# EAGLE design midi (EAGLE 6.5.0)
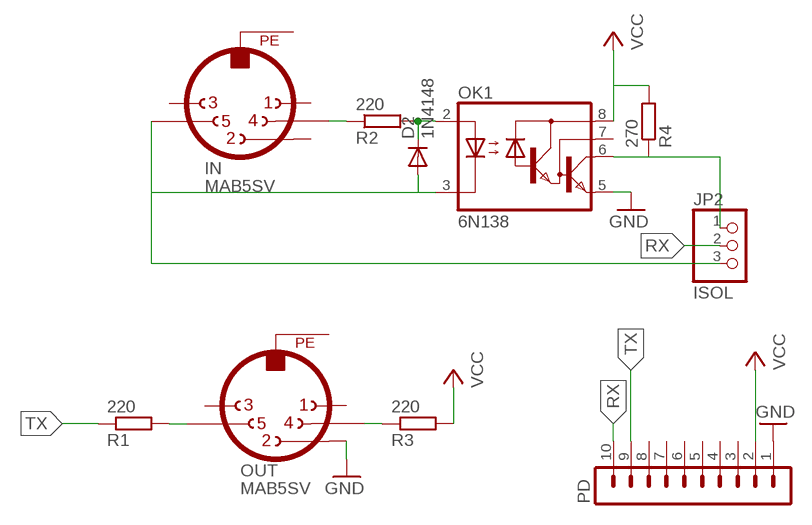
[diagram p0: schematic, sheet 1]

## Parts
D2  1N4148  DIODE-D-2.5  [D-2.5]
IN  MAB5SV  [MAB5SV]
JP2  ISOL  PINHD-1X3/90  [1X03/90]
OK1  6N138  [DIL08]
OUT  MAB5SV  [MAB5SV]
PD  MA10-1W  [MA10-1W]
R1  220  R-EU_0204/7  [0204/7]
R2  220  R-EU_0204/7  [0204/7]
R3  220  R-EU_0207/12  [0207/12]
R4  270  R-EU_0204/5  [0204/5]

## Nets
GND: OK1.5(GND) OUT.2 PD.1
N$1: OUT.4 R3.1
N$2: OUT.5 R1.2
N$3: D2.A IN.5 JP2.3 OK1.3(C)
N$4: D2.C OK1.2(A) R2.2
N$5: IN.4 R2.1
N$6: JP2.1 OK1.6(VO) R4.1
RX: JP2.2 PD.10
TX: PD.9 R1.1
VCC: OK1.8(VCC) PD.2 R3.2 R4.2
Unconnected: IN.1 IN.2 IN.3 OK1.7(VB) OUT.1 OUT.3 PD.3 PD.4 PD.5 PD.6 PD.7 PD.8

## Power pins joined to a net without a drawn wire
PE: IN.PE OUT.PE

## Library data of the parts
D2 = diode:DIODE-: DIODE
IN OUT = con-hirschmann:MAB5SV: Female CONNECTOR 5 pins 90 deg. with shield, vertical (DIN41524); OC_FARNELL: unknown; OC_NEWARK: unknown
JP2 = pinhead:PINHD-1X3: PIN HEADER
OK1 = optocoupler:6N138: MOTOROLA OPTO COUPLER; MF: VISHAY/TELEFUNKEN; MPN: 6N138; OC_FARNELL: 9860150; OC_NEWARK: 35K5294
PD = con-lstb:MA10-1W: PIN HEADER
R1-R4 = rcl:R-EU_: RESISTOR, European symbol

## Board
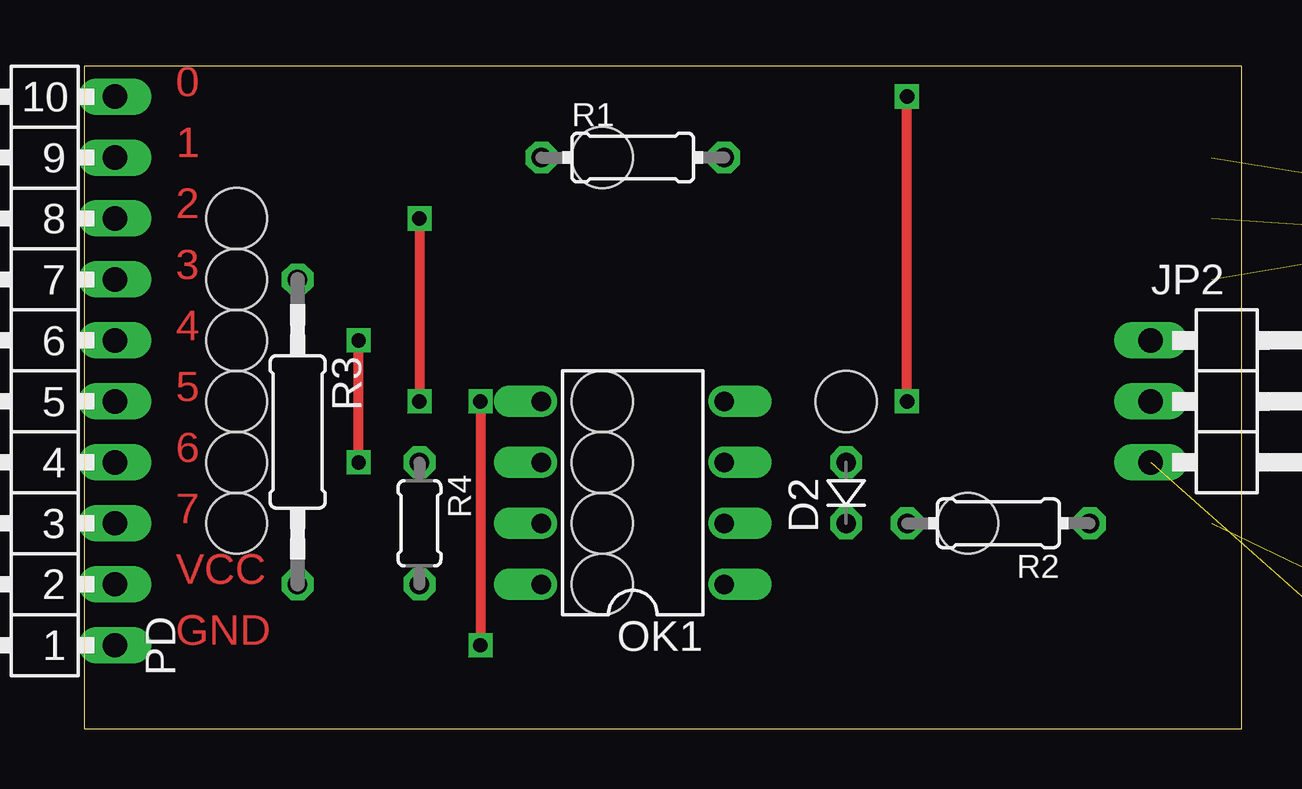
[diagram p1: board, top side]
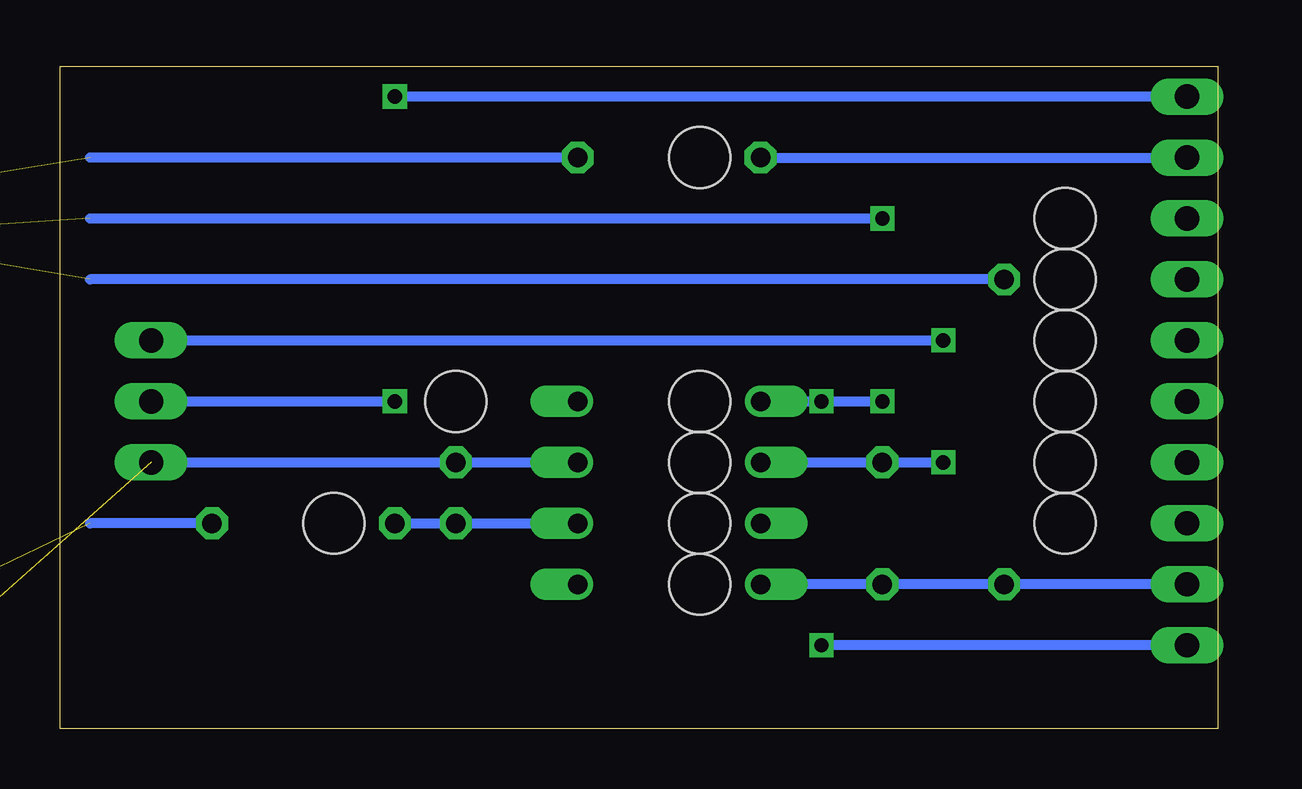
[diagram p2: board, bottom side, seen from below]

Size 48.25 x 27.61 mm. Coordinates in mm from the lower left corner, seen from the top.
Outline: 0,27.61 0,0 48.25,0 48.25,27.61 0,27.61
Copper layers (1*16): Top 0.035mm / dielectric 1.5mm / Bottom 0.035mm
Design rules "default": minimum track width 10mil, minimum drill 24mil, track to track 8mil, track to pad 8mil, pad to pad 8mil, via to via 8mil, smd to smd 8mil, copper to edge 40mil, drill to drill 8mil, minimum pad ring 10mil, minimum via ring 8mil, stop-mask expansion 4mil, vias tented up to drill 0mil, thermal gap 10mil
Holes 2.54 mm at 6.35,18.72 6.35,16.18 6.35,13.64 6.35,11.1 6.35,8.56 6.35,21.26 21.59,13.64 21.59,11.1 21.59,8.56 21.59,6.02 21.59,23.8 36.83,8.56 31.75,13.64

### Footprints (pad centres in the part's own frame; a part is rotated, then mirrored left to right if it is on the bottom)
D-2.5 = drill 0.813 octagon: A 1.27,0; C -1.27,0
MAB5SV = drill 1.321 octagon: 1 6.096,0; 2 0,-6.096; 3 -6.096,0; 4 4.318,-4.318; 5 -4.318,-4.318; PE 0,3.937
1X03/90 = drill 1.016 long: 1 -2.54,-3.81; 2 0,-3.81; 3 2.54,-3.81
DIL08 = drill 0.813 offset: 1 -3.81,-3.81; 2 -1.27,-3.81; 3 1.27,-3.81; 4 3.81,-3.81; 5 3.81,3.81; 6 1.27,3.81; 7 -1.27,3.81; 8 -3.81,3.81
MA10-1W = drill 1.016 long: 1 -11.43,0; 2 -8.89,0; 3 -6.35,0; 4 -3.81,0; 5 -1.27,0; 6 1.27,0; 7 3.81,0; 8 6.35,0; 9 8.89,0; 10 11.43,0
0204/7 = drill 0.813 octagon: 1 -3.81,0; 2 3.81,0
0207/12 = drill 0.813 octagon: 1 -6.35,0; 2 6.35,0
0204/5 = drill 0.813 octagon: 1 -2.54,0; 2 2.54,0

### Placement (x,y rotation side)
D2  31.75,9.83 90 top
IN  62.23,3.48 0 top  (outside the outline)
JP2  48.26,13.64 270 top
OK1  22.86,9.83 90 top
OUT  62.23,26.34 0 top  (outside the outline)
PD  1.27,14.91 90 top
R1  22.86,23.8 0 top
R2  38.1,8.56 180 top
R3  8.89,12.37 270 top
R4  13.97,8.56 270 top

### Tracks (layer width: path | path; a pad name or v marks a point on that pad's centre or on a via)
GND  (via drill 0.6)  (1 unrouted)
  Top 0.406: v16.51,13.64 v16.51,3.48 | v13.97,21.26 v13.97,13.64
  Bottom 0.406: OK1.5 v16.51,13.64 v13.97,13.64 | PD.1 v16.51,3.48 | 46.99,21.26 v13.97,21.26
N$1  (1 unrouted)
  Bottom 0.406: R3.1 46.99,18.72
N$2  (1 unrouted)
  Bottom 0.406: R1.2 46.99,23.8
N$3  (1 unrouted)
  Bottom 0.406: OK1.3 D2.A JP2.3
N$4
  Bottom 0.406: OK1.2 D2.C R2.2
N$5  (1 unrouted)
  Bottom 0.406: R2.1 46.99,8.56
N$6  (via drill 0.6)
  Top 0.406: v11.43,11.1 v11.43,16.18
  Bottom 0.406: OK1.6 R4.1 v11.43,11.1 | JP2.1 v11.43,16.18
PE  (1 unrouted)
RX  (via drill 0.6)
  Top 0.406: v34.29,13.64 v34.29,26.34
  Bottom 0.406: PD.10 v34.29,26.34 | JP2.2 v34.29,13.64
TX
  Bottom 0.406: R1.1 PD.9
VCC
  Bottom 0.406: PD.2 R3.2 R4.2 OK1.8

### Text on the board
Top: 0 | 1 | 2 | 3 | 4 | 5 | 6 | 7 | VCC | GND
Document: RX | OUT5 | TX | OUT2 | OUT4 | ISOLATED INPUT | IN5 | IN4